# Altium schematic sheet core.SchDoc: Core
size A4; Author: Samuel López; DocumentNumber: 1; SheetNumber: 1; SheetTotal: 6
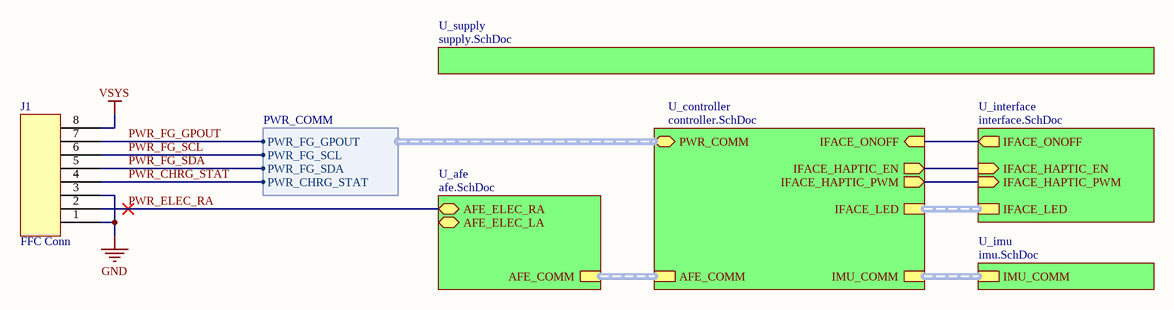
[diagram p0: core.SchDoc]

## Parts
J1  FFC Conn  [WE68610814122]

## Sub-sheets
U_afe = afe.SchDoc: AFE_COMM (harness AFE_COMM), AFE_ELEC_RA (bidir), AFE_ELEC_LA (bidir)
U_controller = controller.SchDoc: IFACE_HAPTIC_EN (out), IFACE_HAPTIC_PWM (out), IFACE_ONOFF (in), IFACE_LED (harness IFACE_LED), AFE_COMM (harness AFE_COMM), IMU_COMM (harness IMU_COMM), PWR_COMM (harness PWR_COMM)
U_imu = imu.SchDoc: IMU_COMM (harness IMU_COMM)
U_interface = interface.SchDoc: IFACE_LED (harness IFACE_LED), IFACE_ONOFF (out), IFACE_HAPTIC_EN (in), IFACE_HAPTIC_PWM (in)
U_supply = supply.SchDoc: no entries

## Harnesses
PWR_COMM: PWR_FG_GPOUT, PWR_FG_SCL, PWR_FG_SDA, PWR_CHRG_STAT

## Nets
GND: J1.1 J1.3
VSYS: J1.8
PWR_CHRG_STAT: J1.4 ; sheet U_controller/PWR_COMM.PWR_CHRG_STAT
PWR_ELEC_RA: J1.2 ; sheet U_afe/AFE_ELEC_RA
PWR_FG_GPOUT: J1.7 ; sheet U_controller/PWR_COMM.PWR_FG_GPOUT
PWR_FG_SCL: J1.6 ; sheet U_controller/PWR_COMM.PWR_FG_SCL
PWR_FG_SDA: J1.5 ; sheet U_controller/PWR_COMM.PWR_FG_SDA
(unnamed): sheet U_controller/IFACE_HAPTIC_EN, sheet U_interface/IFACE_HAPTIC_EN
(unnamed): sheet U_controller/IFACE_HAPTIC_PWM, sheet U_interface/IFACE_HAPTIC_PWM
(unnamed): sheet U_controller/IFACE_ONOFF, sheet U_interface/IFACE_ONOFF

## Buses and harness runs
harness sheet U_afe/AFE_COMM = sheet U_controller/AFE_COMM
harness sheet U_controller/IFACE_LED = sheet U_interface/IFACE_LED
harness sheet U_controller/IMU_COMM = sheet U_imu/IMU_COMM

## Notes on the sheet
- Title:
- Sheet
- of
- Author:
- Date:
- Time:

## Library data of the parts
J1 = WE68610814122: Conn - FFC, 8 Pin, 1 mm Pitch, Top Contacts, SMD, Right Angle, Slide Lock; Supplier 1: Digi-Key; Supplier Part Number 1: 732-2003-1-ND